# Altium project FlyCtrlV5.1.PrjPcb
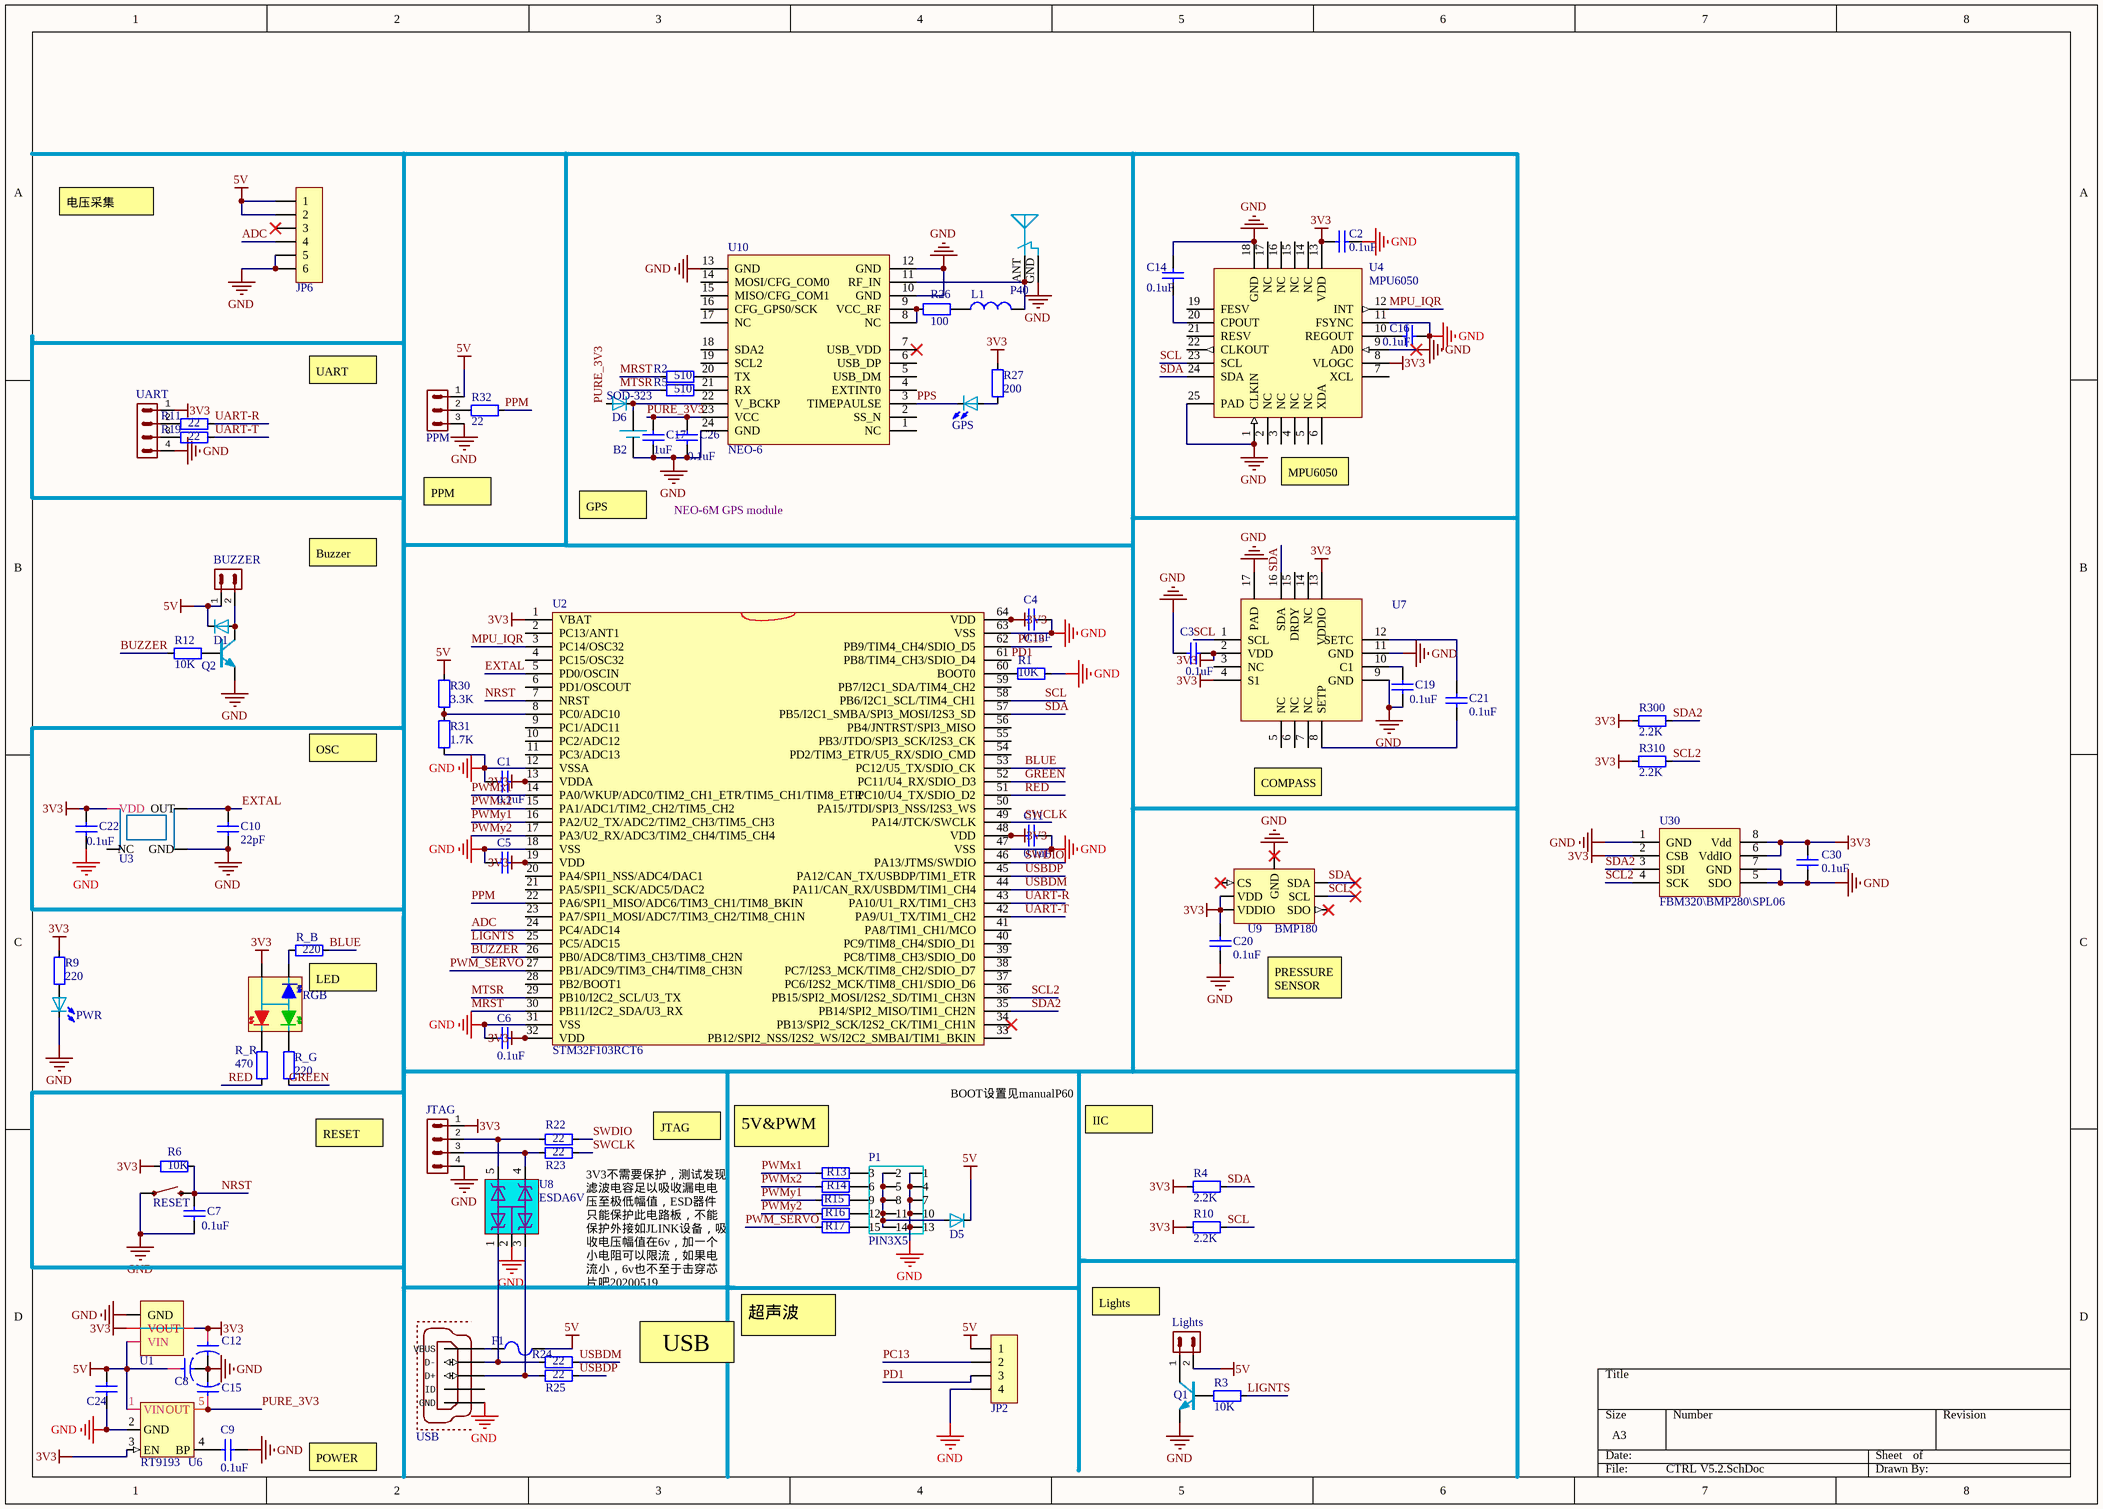
[diagram p0: CTRL V5.2.SchDoc]
2 sheets, 193 parts. Net scope: global (net labels, ports and power ports of the same name join across sheets).
Board files: CTRL V5.PcbDoc, CTRL V5.2.PcbDoc
Sheets:
  CTRL V5.2.SchDoc
  CTRL V5.SchDoc

## Sheet CTRL V5.2.SchDoc
size A3

### Parts
(Parts that share a designator on the sheet are numbered #1, #2 ... from top to bottom, then left to right.)
B2#1  XH414  [XH414]  (value not drawn)
BUZZER#1  DF13C-2P  [DF13C-2P-1.25V]  (value not drawn)
C1#1  0.1uF  [0603-CAP]
C2#1  0.1uF  [0603-CAP]
C3#1  0.1uF  [0603-CAP]
C4#1  0.1uF  [0603-CAP]
C5#1  0.1uF  [0603-CAP]  (value not drawn)
C6#1  0.1uF  [0603-CAP]
C7  0.1uF  [0603-CAP]
C8#1  10uF  [TAJ-A(1206)[3216]]  (value not drawn)
C9#1  0.1uF  [0603-CAP]
C10  22pF  [0603-CAP]
C11#1  0.1uF  [0603-CAP]
C12#1  10uF  [TAJ-A(1206)[3216]]  (value not drawn)
C14#1  0.1uF  [0603-CAP]
C15#1  10uF  [TAJ-A(1206)[3216]]  (value not drawn)
C16#1  0.1uF  [0603-CAP]
C17#1  1uF  [0805-CAP]
C19#1  0.1uF  [0603-CAP]
C20#1  0.1uF  [0603-CAP]
C21#1  0.1uF  [0603-CAP]
C22  0.1uF  [0603-CAP]
C24#1  0.1uF  [0805-CAP]  (value not drawn)
C26#1  0.1uF  [0603-CAP]
C30#1  value 0.1uF  [C_0603]  (hidden comment: C_0603)
D1#1  IN5819  [SOD-323]  (value not drawn)
D5#1  1N4148  [SOD-523]  (value not drawn)
D6#1  SOD-323  [SOD-323]
F1#1  FUSE  [0805-FUS]  (value not drawn)
GPS#1  LED  [0805-LED]  (value not drawn)
JP2  HDR-1X4  [HDR-1X4]  (value not drawn)
JP6  HDR-1X6  [TX1.25 SMD-4P]  (value not drawn)
JTAG#1  PIN HDR 1x4  [PIN4*1]  (value not drawn)
L1#1  value  [0805-IND]  (value not drawn)
Lights#1  DF13C-2P  [DF13C-2P-1.25V]  (value not drawn)
P1#1  PIN3X5  [PIN HDR3X5]
P40#1  IPEX  [IPEX]  (value not drawn)
PPM#1  PIN HDR 1X3  [PIN3*1]  (value not drawn)
PWR#1  LED  [0805-LED]  (value not drawn)
Q1#1  2N3904  [SOT-23]  (value not drawn)
Q2#1  2N3904  [SOT-23]  (value not drawn)
R1#1  10K  [0603-Res]
R2#1  510  [0603-Res]
R3#1  10K  [0603-Res]
R4#1  2.2K  [0603-Res]
R5#1  510  [0603-Res]
R6  10K  [0603-Res]
R9#1  220  [0603-Res]
R10#1  2.2K  [0603-Res]
R11#1  22  [0603-Res]
R12#1  10K  [0603-Res]
R13#1  220  [0603-Res]  (value not drawn)
R14#1  220  [0603-Res]  (value not drawn)
R15#1  220  [0603-Res]  (value not drawn)
R16#1  220  [0603-Res]  (value not drawn)
R17#1  220  [0603-Res]  (value not drawn)
R19#1  22  [0603-Res]
R22#1  22  [0603-Res]
R23#1  22  [0603-Res]
R24#1  22  [0603-Res]
R25#1  22  [0603-Res]
R26#1  100  [0603-Res]
R27#1  200  [0603-Res]
R30  3.3K  [0603-Res]
R31  1.7K  [0603-Res]
R32#1  22  [0603-Res]
R300  2.2K  [0603-Res]
R310  2.2K  [0603-Res]
R_B#1  220  [0603-Res]
R_G#1  220  [0603-Res]
R_R#1  470  [0603-Res]
RESET  KEY_2PIN  [KEY-SMD-2P-1]  (value not drawn)
RGB#1  3528LED  [1210-RGBLED]  (value not drawn)
U1#1  AMS1117-3.3  [SOT-223]  (value not drawn)
U2#1  STM32F103RCT6  [LQFP-64-S]
U3  5032-8M  [XTAL-5032-4P]  (value not drawn)
U4#1  MPU6050  [QFN-24]
U6#1  RT9193  [SOT23-5]
U7#1  HMC5883  [QFN-16-L]  (value not drawn)
U8#1  ESDA6V1W5(Eb1)  [SOT323-5L]
U9#1  BMP180  [BMP180-WITHSHELL]
U10#1  NEO-6  [NEO-6]
U30  FBM320\BMP280\SPL06  [LGA-2_5X2MM]
UART#1  SH1.0-4P  [SH1.0 S-W-4P]  (value not drawn)
USB#1  USB-MICRO  [USB_MICRO]  (value not drawn)

### Nets
3V3: C1#1.1 C2#1.1 C3#1.2 C4#1.2 C5#1.2 C6#1.1 C11#1.2 C12#1.A C20#1.2 C22.2 C30#1.1 JTAG#1.1 R4#1.2 R6.1 R9#1.1 R10#1.2 R27#1.2 R300.2 R310.2 RGB#1.VCC U1#1.2(VOUT) U1#1.4(VOUT) U2#1.1(VBAT) U2#1.13(VDDA) U2#1.19(VDD) U2#1.32(VDD) U2#1.48(VDD) U2#1.64(VDD) U3.4(VDD) U4#1.8(VLOGC) U4#1.13(VDD) U6#1.3(EN) U7#1.2(VDD) U7#1.4(S1) U7#1.13(VDDIO) U9#1.2(VDD) U9#1.3(VDDIO) U30.2(CSB) U30.6(VddIO) U30.8(Vdd) UART#1.1
5V: BUZZER#1.1 C8#1.A C24#1.2 D1#1.C D5#1.C F1#1.1 JP2.1 JP6.1 JP6.2 Lights#1.2 PPM#1.1 R30.1 U1#1.3(VIN) U6#1.1(VIN)
GND: B2#1.GND C1#1.2 C2#1.2 C3#1.1 C4#1.1 C5#1.1 C6#1.2 C7.1 C8#1.C(K) C9#1.2 C10.1 C11#1.1 C12#1.C(K) C14#1.2 C15#1.C(K) C16#1.2 C17#1.1 C19#1.1 C20#1.1 C22.1 C24#1.1 C26#1.1 C30#1.2 JP2.4 JP6.5 JP6.6 JTAG#1.4 P1#1.1 P1#1.4 P1#1.7 P1#1.10 P1#1.13 P40#1.GND PPM#1.3 PWR#1.C Q1#1.1 Q2#1.1 R1#1.1 R31.2 RESET.1 U1#1.1(GND) U2#1.12(VSSA) U2#1.18(VSS) U2#1.31(VSS) U2#1.47(VSS) U2#1.63(VSS) U3.2(GND) U4#1.1(CLKIN) U4#1.9(AD0) U4#1.11(FSYNC) U4#1.18(GND) U4#1.25(PAD) U6#1.2(GND) U7#1.9(GND) U7#1.11(GND) U7#1.17(PAD) U8#1.2(GND) U9#1.7(GND) U10#1.10(GND) U10#1.12(GND) U10#1.13(GND) U10#1.24(GND) U30.1(GND) U30.5(SDO) U30.7(GND) UART#1.4 USB#1.GND
ADC: JP6.4 U2#1.24(PC4/ADC14)
BLUE: R_B#1.2 U2#1.53(PC12/U5_TX/SDIO_CK)
BUZZER: R12#1.2 U2#1.26(PB0/ADC8/TIM3_CH3/TIM8_CH2N)
EXTAL: C10.2 U2#1.5(PD0/OSCIN) U3.3(OUT)
GREEN: R_G#1.2 U2#1.52(PC11/U4_RX/SDIO_D3)
LIGNTS: R3#1.1 U2#1.25(PC5/ADC15)
MPU_IQR: U2#1.3(PC14/OSC32) U4#1.12(INT)
MRST: R2#1.1 U2#1.30(PB11/I2C2_SDA/U3_RX)
MTSR: R5#1.1 U2#1.29(PB10/I2C2_SCL/U3_TX)
NRST: C7.2 R6.2 RESET.2 U2#1.7(NRST)
PC13: JP2.2 U2#1.62(PB9/TIM4_CH4/SDIO_D5)
PD1: JP2.3 U2#1.61(PB8/TIM4_CH3/SDIO_D4)
PPM: R32#1.1 U2#1.22(PA6/SPI1_MISO/ADC6/TIM3_CH1/TIM8_BKIN)
PPS: GPS#1.C U10#1.3(TIMEPAULSE)
PURE_3V3: C15#1.A C17#1.2 C26#1.2 D6#1.A U6#1.5(OUT) U10#1.23(VCC)
PWM_SERVO: R17#1.2 U2#1.27(PB1/ADC9/TIM3_CH4/TIM8_CH3N)
PWMx1: R13#1.2 U2#1.14(PA0/WKUP/ADC0/TIM2_CH1_ETR/TIM5_CH1/TIM8_ETR)
PWMx2: R14#1.2 U2#1.15(PA1/ADC1/TIM2_CH2/TIM5_CH2)
PWMy1: R15#1.2 U2#1.16(PA2/U2_TX/ADC2/TIM2_CH3/TIM5_CH3)
PWMy2: R16#1.2 U2#1.17(PA3/U2_RX/ADC3/TIM2_CH4/TIM5_CH4)
RED: R_R#1.2 U2#1.51(PC10/U4_TX/SDIO_D2)
SCL: R10#1.1 U2#1.58(PB6/I2C1_SCL/TIM4_CH1) U4#1.23(SCL) U7#1.1(SCL) U9#1.5(SCL)
SCL2: R310.1 U2#1.36(PB15/SPI2_MOSI/I2S2_SD/TIM1_CH3N) U30.4(SCK)
SDA: R4#1.1 U2#1.57(PB5/I2C1_SMBA/SPI3_MOSI/I2S3_SD) U4#1.24(SDA) U7#1.16(SDA) U9#1.6(SDA)
SDA2: R300.1 U2#1.35(PB14/SPI2_MISO/TIM1_CH2N) U30.3(SDI)
SWCLK: R23#1.2 U2#1.49(PA14/JTCK/SWCLK)
SWDIO: R22#1.2 U2#1.46(PA13/JTMS/SWDIO)
UART-R: R11#1.2 U2#1.43(PA10/U1_RX/TIM1_CH3)
UART-T: R19#1.2 U2#1.42(PA9/U1_TX/TIM1_CH2)
USBDM: R24#1.2 U2#1.44(PA11/CAN_RX/USBDM/TIM1_CH4)
USBDP: R25#1.2 U2#1.45(PA12/CAN_TX/USBDP/TIM1_ETR)
NetB2#1_VCC: B2#1.VCC D6#1.C U10#1.22(V_BCKP)
NetBUZZER#1_2: BUZZER#1.2 D1#1.A Q2#1.3
NetC9#1_1: C9#1.1 U6#1.4(BP)
NetC14#1_1: C14#1.1 U4#1.20(CPOUT)
NetC16#1_1: C16#1.1 U4#1.10(REGOUT)
NetC19#1_2: C19#1.2 U7#1.10(C1)
NetC21#1_1: C21#1.1 U7#1.8(SETP)
NetC21#1_2: C21#1.2 U7#1.12(SETC)
NetD5#1_A: D5#1.A P1#1.2 P1#1.5 P1#1.8 P1#1.11 P1#1.14
NetF1#1_2: F1#1.2 USB#1.VBUS
NetGPS#1_A: GPS#1.A R27#1.1
NetJTAG#1_2: JTAG#1.2 R22#1.1 U8#1.5(D4)
NetJTAG#1_3: JTAG#1.3 R23#1.1 U8#1.4(D3)
NetL1#1_1: L1#1.1 R26#1.2
NetL1#1_2: L1#1.2 P40#1.ANT U10#1.11(RF_IN)
NetLights#1_1: Lights#1.1 Q1#1.3
NetP1#1_3: P1#1.3 R13#1.1
NetP1#1_6: P1#1.6 R14#1.1
NetP1#1_9: P1#1.9 R15#1.1
NetP1#1_12: P1#1.12 R16#1.1
NetP1#1_15: P1#1.15 R17#1.1
NetPPM#1_2: PPM#1.2 R32#1.2
NetPWR#1_A: PWR#1.A R9#1.2
NetQ1#1_2: Q1#1.2 R3#1.2
NetQ2#1_2: Q2#1.2 R12#1.1
NetR1#1_2: R1#1.2 U2#1.60(BOOT0)
NetR2#1_2: R2#1.2 U10#1.20(TX)
NetR5#1_2: R5#1.2 U10#1.21(RX)
NetR11#1_1: R11#1.1 UART#1.2
NetR19#1_1: R19#1.1 UART#1.3
NetR24#1_1: R24#1.1 U8#1.1(D1) USB#1.D-
NetR25#1_1: R25#1.1 U8#1.3(D2) USB#1.D+
NetR26#1_1: R26#1.1 U10#1.8(NC) U10#1.9(VCC_RF)
NetR30_2: R30.2 R31.1 U2#1.8(PC0/ADC10)
NetR_B#1_1: R_B#1.1 RGB#1.B
NetR_G#1_1: R_G#1.1 RGB#1.G
NetR_R#1_1: R_R#1.1 RGB#1.R

Not connected (* = marked no-connect by the designer): JP6 3*; U2#1 2(PC13/ANT1) 4(PC15/OSC32) 6(PD1/OSCOUT) 9(PC1/ADC11) 10(PC2/ADC12) 11(PC3/ADC13) 20(PA4/SPI1_NSS/ADC4/DAC1) 21(PA5/SPI1_SCK/ADC5/DAC2) 23(PA7/SPI1_MOSI/ADC7/TIM3_CH2/TIM8_CH1N) 28(PB2/BOOT1) 33(PB12/SPI2_NSS/I2S2_WS/I2C2_SMBAI/TIM1_BKIN) 34(PB13/SPI2_SCK/I2S2_CK/TIM1_CH1N)* 37(PC6/I2S2_MCK/TIM8_CH1/SDIO_D6) 38(PC7/I2S3_MCK/TIM8_CH2/SDIO_D7) 39(PC8/TIM8_CH3/SDIO_D0) 40(PC9/TIM8_CH4/SDIO_D1) 41(PA8/TIM1_CH1/MCO) 50(PA15/JTDI/SPI3_NSS/I2S3_WS) 54(PD2/TIM3_ETR/U5_RX/SDIO_CMD) 55(PB3/JTDO/SPI3_SCK/I2S3_CK) 56(PB4/JNTRST/SPI3_MISO) 59(PB7/I2C1_SDA/TIM4_CH2); U3 1(NC); U4#1 2(NC) 3(NC) 4(NC) 5(NC) 6(XDA) 7(XCL) 14(NC) 15(NC) 16(NC) 17(NC) 19(FESV) 21(RESV) 22(CLKOUT); U7#1 3(NC) 5(NC) 6(NC) 7(NC) 14(NC) 15(DRDY); U9#1 1(CS)* 4(SDO)*; U10#1 1(NC) 2(SS_N) 4(EXTINT0) 5(USB_DM) 6(USB_DP) 7(USB_VDD)* 14(MOSI/CFG_COM0) 15(MISO/CFG_COM1) 16(CFG_GPS0/SCK) 17(NC) 18(SDA2) 19(SCL2); USB#1 ID

### Notes on the sheet
- 电压采集
- UART
- PPM
- GPS
- NEO-6M GPS module
- (near U4#1) MPU6050
- Buzzer
- OSC
- COMPASS
- LED
- PRESSURE SENSOR
- BOOT设置见manualP60
- IIC
- RESET
- JTAG
- 5V&PWM
- 3V3不需要保护，测试发现滤波电容足以吸收漏电电压至极低幅值，ESD器件只能保护此电路板，不能保护外接如JLINK设备，吸收电压幅值在6v，加一个小电阻可以限流，如果电流小，6v也不至于击穿芯片吧20200519
- Lights
- USB
- 超声波
- POWER

### Library data of the parts
B2#1 = XH414: XH414贴片法拉电容φ4.7
BUZZER#1 = PIN HDR 1x2: DF13C-2PHeader, 2-Pin; LatestRevisionDate: 17-Jul-2002; LatestRevisionNote: Re-released for DXP Platform.; Publisher: Altium Limited
C1#1 C2#1 C3#1 C4#1 C5#1 C6#1 C7 C9#1 C11#1 C14#1 C16#1 C19#1 C20#1 C21#1 C22 C24#1 C26#1 = Cap: 无极性Cap; Voltage: 50V; Published: 8-Jun-2000; LatestRevisionDate: 17-Jul-2002; LatestRevisionNote: Re-released for DXP Platform.; PackageReference: RAD-0.3; Publisher: Altium Limited; PackageDescription: Radial Cap, Thru-Hole; 2 Leads; 0.3 in Pin Spacing; Footprint: 0603; Value: 0.1uF
C8#1 C12#1 C15#1 = Cap_p: 有极性Cap
C10 C17#1 = Cap: 无极性Cap; Voltage: 50V; Value: 0.1uF; Published: 8-Jun-2000; LatestRevisionDate: 17-Jul-2002; LatestRevisionNote: Re-released for DXP Platform.; PackageReference: RAD-0.3; Publisher: Altium Limited; PackageDescription: Radial Cap, Thru-Hole; 2 Leads; 0.3 in Pin Spacing; Footprint: 0603
D1#1 = DIODE: 续流
D5#1 D6#1 = DIODE
F1#1 = FUSE: 熔断器
JP2 = Header 4: 4P接插件; 版权归属: 源创客; BOM名称: 4P接插件; 学习资源: www.ooocke.com
JP6 = Header 6: 6P接插件; 版权归属: 源创客; BOM名称: 6P接插件; 学习资源: www.ooocke.com
JTAG#1 = PIN HDR 1x4: 1x4-Pin-connector-JTAG; LatestRevisionDate: 17-Jul-2002; LatestRevisionNote: Re-released for DXP Platform.; Publisher: Altium Limited
L1#1 = Inductor: 电感; value: 27nH
Lights#1 = PIN HDR 1x2: Header, 2-Pin; LatestRevisionDate: 17-Jul-2002; LatestRevisionNote: Re-released for DXP Platform.; Publisher: Altium Limited
P1#1 = PIN HDR3x5
P40#1 = IPEX: IPEX天线座
Q1#1 Q2#1 = NPN: NPN三极管
R1#1 R3#1 R4#1 R6 R9#1 R10#1 R11#1 R12#1 R13#1 R14#1 R15#1 R16#1 R17#1 R19#1 R22#1 R23#1 R24#1 R25#1 R26#1 R27#1 R30 R31 R32#1 R300 R310 R_B#1 R_G#1 R_R#1 = Res: Resistor; Value: 1K; Published: 8-Jun-2000; LatestRevisionDate: 17-Jul-2002; LatestRevisionNote: Re-released for DXP Platform.; PackageReference: AXIAL-0.4; Publisher: Altium Limited; Footprint: 0603
R2#1 R5#1 = RES: Resistor; Value: 1K; Published: 8-Jun-2000; LatestRevisionDate: 17-Jul-2002; LatestRevisionNote: Re-released for DXP Platform.; PackageReference: AXIAL-0.4; Publisher: Altium Limited
RGB#1 = LED-RGB-4PIN
U1#1 = AMS1117
U3 = XTAL-5032-4P: 4PIN-5032晶振
U4#1 = MPU6050: dscrps三轴陀螺仪加速度计
U7#1 = HMC5883: 地磁计
U8#1 = ESDA6V1W5(Eb1): ESD protection
U9#1 = BMP180: Special BOSCH pressure sensor
U10#1 = NEO-6: GPS
U30 = FBM320: 气压计; Published: 8-August-2017; Publisher: mazhongwei; PackageReference: LGA-2_5X2MM
UART#1 = PIN HDR 1x4: SH1.0-4P 1x4-Pin-connector; LatestRevisionDate: 17-Jul-2002; LatestRevisionNote: Re-released for DXP Platform.; Publisher: Altium Limited
USB#1 = USB
C30#1 = C_0603: Published: 8-Jun-2000; LatestRevisionDate: 17-Jul-2002; LatestRevisionNote: Re-released for DXP Platform.; PackageReference: RAD-0.3; Publisher: Altium Limited; PackageDescription: Radial Cap, Thru-Hole; 2 Leads; 0.3 in Pin Spacing

## Sheet CTRL V5.SchDoc
size A3
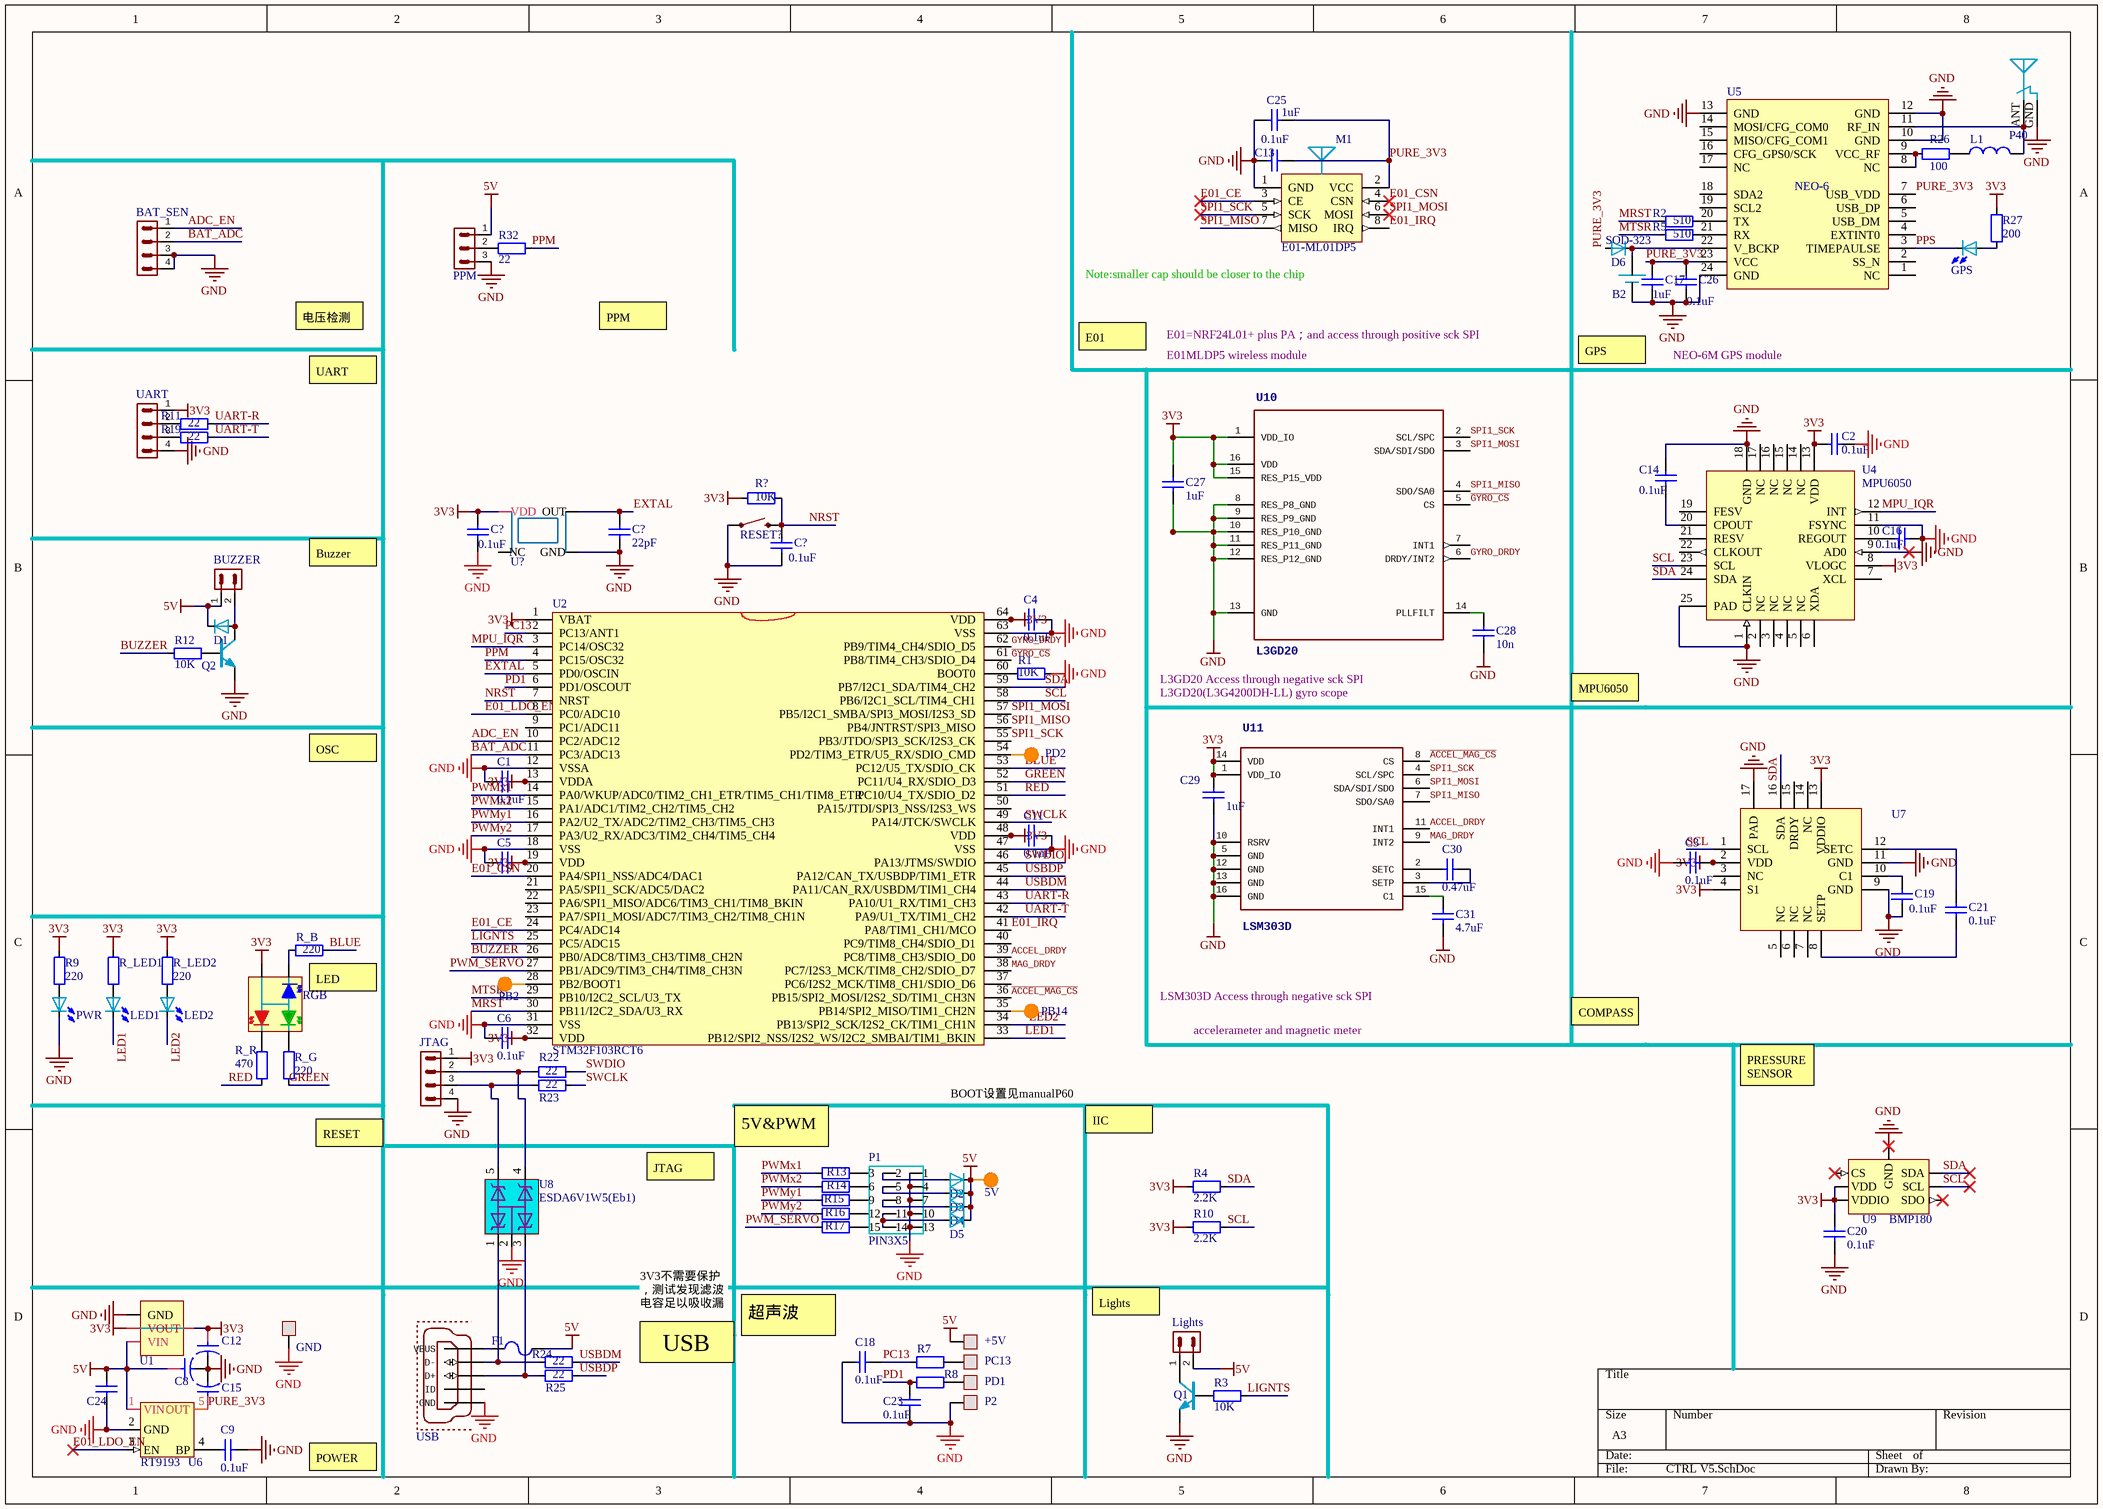
[diagram p1: CTRL V5.SchDoc]

### Parts
(Parts that share a designator on the sheet are numbered #1, #2 ... from top to bottom, then left to right.)
5V  voltage  [TEST_P]  (value not drawn)
+5V  voltage  [PIN1*1]  (value not drawn)
B2#2  XH414  [XH414]  (value not drawn)
BAT_SEN  DF13C-4P  [DF13C-4P-1.25V]  (value not drawn)
BUZZER#2  DF13C-2P  [DF13C-2P-1.25V]  (value not drawn)
C1#2  0.1uF  [0603-CAP]
C2#2  0.1uF  [0603-CAP]
C3#2  0.1uF  [0603-CAP]
C4#2  0.1uF  [0603-CAP]
C5#2  0.1uF  [0603-CAP]  (value not drawn)
C6#2  0.1uF  [0603-CAP]
C8#2  10uF  [TAJ-A(1206)[3216]]  (value not drawn)
C9#2  0.1uF  [0603-CAP]
C11#2  0.1uF  [0603-CAP]
C12#2  10uF  [TAJ-A(1206)[3216]]  (value not drawn)
C13  0.1uF  [0603-CAP]
C14#2  0.1uF  [0603-CAP]
C15#2  10uF  [TAJ-A(1206)[3216]]  (value not drawn)
C16#2  0.1uF  [0603-CAP]
C17#2  1uF  [0805-CAP]
C18  0.1uF  [0603-CAP]
C19#2  0.1uF  [0603-CAP]
C20#2  0.1uF  [0603-CAP]
C21#2  0.1uF  [0603-CAP]
C23  0.1uF  [0603-CAP]
C24#2  0.1uF  [0805-CAP]  (value not drawn)
C25  1uF  [0805-CAP]
C26#2  0.1uF  [0603-CAP]
C27  1uF  [0805-CAP]
C28  10n  [0603-CAP]
C29  1uF  [0805-CAP]
C30#2  0.47uF  [0603-CAP]
C31  4.7uF  [0805-CAP]
C?#1  0.1uF  [0603-CAP]
C?#2  22pF  [0603-CAP]
C?#3  0.1uF  [0603-CAP]
D1#2  shotechy  [SOD-323]  (value not drawn)
D2  1N4148  [SOD-523]  (value not drawn)
D3  1N4148  [SOD-523]  (value not drawn)
D4  1N4148  [SOD-523]  (value not drawn)
D5#2  1N4148  [SOD-523]  (value not drawn)
D6#2  SOD-323  [SOD-323]
F1#2  FUSE  [0805-FUS]  (value not drawn)
GND  voltage  [PIN1*1]  (value not drawn)
GPS#2  LED  [0805-LED]  (value not drawn)
JTAG#2  PIN HDR 1x4  [PIN4*1]  (value not drawn)
L1#2  value  [0805-IND]  (value not drawn)
LED1  LED  [0805-LED]  (value not drawn)
LED2  LED  [0805-LED]  (value not drawn)
Lights#2  DF13C-2P  [DF13C-2P-1.25V]  (value not drawn)
M1  E01-ML01DP5  [E01-ML01DP5 - SMD]
P1#2  PIN3X5  [PIN HDR3X5]
P2  voltage  [PIN1*1]  (value not drawn)
P40#2  IPEX  [IPEX]  (value not drawn)
PB2  voltage  [TEST_P]  (value not drawn)
PB14  voltage  [TEST_P]  (value not drawn)
PC13  voltage  [PIN1*1]  (value not drawn)
PD1  voltage  [PIN1*1]  (value not drawn)
PD2  voltage  [TEST_P]  (value not drawn)
PPM#2  PIN HDR 1X3  [PIN3*1]  (value not drawn)
PWR#2  LED  [0805-LED]  (value not drawn)
Q1#2  2N3904  [SOT-23]  (value not drawn)
Q2#2  2N3904  [SOT-23]  (value not drawn)
R1#2  10K  [0603-Res]
R2#2  510  [0603-Res]
R3#2  10K  [0603-Res]
R4#2  2.2K  [0603-Res]
R5#2  510  [0603-Res]
R7  220  [0603-Res]  (value not drawn)
R8  220  [0603-Res]  (value not drawn)
R9#2  220  [0603-Res]
R10#2  2.2K  [0603-Res]
R11#2  22  [0603-Res]
R12#2  10K  [0603-Res]
R13#2  220  [0603-Res]  (value not drawn)
R14#2  220  [0603-Res]  (value not drawn)
R15#2  220  [0603-Res]  (value not drawn)
R16#2  220  [0603-Res]  (value not drawn)
R17#2  220  [0603-Res]  (value not drawn)
R19#2  22  [0603-Res]
R22#2  22  [0603-Res]
R23#2  22  [0603-Res]
R24#2  22  [0603-Res]
R25#2  22  [0603-Res]
R26#2  100  [0603-Res]
R27#2  200  [0603-Res]
R32#2  22  [0603-Res]
R?  10K  [0603-Res]
R_B#2  220  [0603-Res]
R_G#2  220  [0603-Res]
R_LED1  220  [0603-Res]  (value not drawn)
R_LED2  220  [0603-Res]
R_R#2  470  [0603-Res]
RESET?  KEY_2PIN  [KEY-SMD-2P-1]  (value not drawn)
RGB#2  3528LED  [1210-RGBLED]  (value not drawn)
U1#2  AMS1117-3.3  [SOT-223]  (value not drawn)
U2#2  STM32F103RCT6  [LQFP-64-S]
U4#2  MPU6050  [QFN-24]
U5  NEO-6  [NEO-6]
U6#2  RT9193  [SOT23-5]
U7#2  HMC5883  [QFN-16-L]  (value not drawn)
U8#2  ESDA6V1W5(Eb1)  [SOT323-5L]
U9#2  BMP180  [BMP180-WITHSHELL]
U10#2  L3GD20  [L3G4200DH-MAN]
U11  LSM303D  [LGA-16L]
U?  5032-8M  [XTAL-5032-4P]  (value not drawn)
UART#2  SH1.0-4P  [SH1.0 S-W-4P]  (value not drawn)
USB#2  USB-MICRO  [USB_MICRO]  (value not drawn)

### Nets
3V3: C1#2.1 C2#2.1 C3#2.2 C4#2.2 C5#2.2 C6#2.1 C11#2.2 C12#2.A C20#2.2 C27.2 C29.2 C?#1.2 JTAG#2.1 R4#2.2 R9#2.1 R10#2.2 R27#2.2 R?.1 R_LED1.1 R_LED2.1 RGB#2.VCC U1#2.2(VOUT) U1#2.4(VOUT) U2#2.1(VBAT) U2#2.13(VDDA) U2#2.19(VDD) U2#2.32(VDD) U2#2.48(VDD) U2#2.64(VDD) U4#2.8(VLOGC) U4#2.13(VDD) U7#2.2(VDD) U7#2.4(S1) U7#2.13(VDDIO) U9#2.2(VDD) U9#2.3(VDDIO) U10#2.1(VDD_IO) U10#2.15(RES_P15_VDD) U10#2.16(VDD) U11.1(VDD_IO) U11.14(VDD) U?.4(VDD) UART#2.1
5V: 5V.1 +5V.1 BUZZER#2.1 C8#2.A C24#2.2 D1#2.C D2.C D3.C D4.C D5#2.C F1#2.1 Lights#2.2 PPM#2.1 U1#2.3(VIN) U6#2.1(VIN)
GND: B2#2.GND BAT_SEN.3 BAT_SEN.4 C1#2.2 C2#2.2 C3#2.1 C4#2.1 C5#2.1 C6#2.2 C8#2.C(K) C9#2.2 C11#2.1 C12#2.C(K) C13.1 C14#2.2 C15#2.C(K) C16#2.2 C17#2.1 C18.1 C19#2.1 C20#2.1 C23.1 C24#2.1 C25.2 C26#2.1 C27.1 C28.1 C29.1 C31.1 C?#1.1 C?#2.1 C?#3.1 GND.1 JTAG#2.4 M1.1(GND) P1#2.1 P1#2.4 P1#2.7 P1#2.10 P1#2.13 P2.1 P40#2.GND PPM#2.3 PWR#2.C Q1#2.1 Q2#2.1 R1#2.1 RESET?.1 U1#2.1(GND) U2#2.12(VSSA) U2#2.18(VSS) U2#2.31(VSS) U2#2.47(VSS) U2#2.63(VSS) U4#2.1(CLKIN) U4#2.9(AD0) U4#2.11(FSYNC) U4#2.18(GND) U4#2.25(PAD) U5.10(GND) U5.12(GND) U5.13(GND) U5.24(GND) U6#2.2(GND) U7#2.9(GND) U7#2.11(GND) U7#2.17(PAD) U8#2.2(GND) U9#2.7(GND) U10#2.8(RES_P8_GND) U10#2.9(RES_P9_GND) U10#2.10(RES_P10_GND) U10#2.11(RES_P11_GND) U10#2.12(RES_P12_GND) U10#2.13(GND) U11.5(GND) U11.10(RSRV) U11.12(GND) U11.13(GND) U11.16(GND) U?.2(GND) UART#2.4 USB#2.GND
~{ACCEL_MAG_CS}: U2#2.36(PB15/SPI2_MOSI/I2S2_SD/TIM1_CH3N) U11.8(CS)
ACCEL_DRDY: U2#2.39(PC8/TIM8_CH3/SDIO_D0) U11.11(INT1)
ADC_EN: BAT_SEN.1 U2#2.10(PC2/ADC12)
BAT_ADC: BAT_SEN.2 U2#2.11(PC3/ADC13)
BLUE: R_B#2.2 U2#2.53(PC12/U5_TX/SDIO_CK)
BUZZER: R12#2.2 U2#2.26(PB0/ADC8/TIM3_CH3/TIM8_CH2N)
E01_CE: M1.3(CE) U2#2.24(PC4/ADC14)
E01_CSN: M1.4(CSN) U2#2.20(PA4/SPI1_NSS/ADC4/DAC1)
E01_IRQ: M1.8(IRQ) U2#2.41(PA8/TIM1_CH1/MCO)
E01_LDO_EN: U2#2.8(PC0/ADC10) U6#2.3(EN)
EXTAL: C?#2.2 U2#2.5(PD0/OSCIN) U?.3(OUT)
~{GYRO_CS}: U2#2.61(PB8/TIM4_CH3/SDIO_D4) U10#2.5(CS)
GREEN: R_G#2.2 U2#2.52(PC11/U4_RX/SDIO_D3)
GYRO_DRDY: U2#2.62(PB9/TIM4_CH4/SDIO_D5) U10#2.6(DRDY/INT2)
LED1: LED1.C U2#2.33(PB12/SPI2_NSS/I2S2_WS/I2C2_SMBAI/TIM1_BKIN)
LED2: LED2.C U2#2.34(PB13/SPI2_SCK/I2S2_CK/TIM1_CH1N)
LIGNTS: R3#2.1 U2#2.25(PC5/ADC15)
MAG_DRDY: U2#2.38(PC7/I2S3_MCK/TIM8_CH2/SDIO_D7) U11.9(INT2)
MPU_IQR: U2#2.3(PC14/OSC32) U4#2.12(INT)
MRST: R2#2.1 U2#2.30(PB11/I2C2_SDA/U3_RX)
MTSR: R5#2.1 U2#2.29(PB10/I2C2_SCL/U3_TX)
NRST: C?#3.2 R?.2 RESET?.2 U2#2.7(NRST)
PC13: C18.2 R7.1 U2#2.2(PC13/ANT1)
PD1: C23.2 R8.1 U2#2.6(PD1/OSCOUT)
PPM: R32#2.1 U2#2.4(PC15/OSC32)
PPS: GPS#2.C U5.3(TIMEPAULSE)
PURE_3V3: C13.2 C15#2.A C17#2.2 C25.1 C26#2.2 D6#2.A M1.2(VCC) U5.7(USB_VDD) U5.23(VCC) U6#2.5(OUT)
PWM_SERVO: R17#2.2 U2#2.27(PB1/ADC9/TIM3_CH4/TIM8_CH3N)
PWMx1: R13#2.2 U2#2.14(PA0/WKUP/ADC0/TIM2_CH1_ETR/TIM5_CH1/TIM8_ETR)
PWMx2: R14#2.2 U2#2.15(PA1/ADC1/TIM2_CH2/TIM5_CH2)
PWMy1: R15#2.2 U2#2.16(PA2/U2_TX/ADC2/TIM2_CH3/TIM5_CH3)
PWMy2: R16#2.2 U2#2.17(PA3/U2_RX/ADC3/TIM2_CH4/TIM5_CH4)
RED: R_R#2.2 U2#2.51(PC10/U4_TX/SDIO_D2)
SCL: R10#2.1 U2#2.58(PB6/I2C1_SCL/TIM4_CH1) U4#2.23(SCL) U7#2.1(SCL) U9#2.5(SCL)
SDA: R4#2.1 U2#2.59(PB7/I2C1_SDA/TIM4_CH2) U4#2.24(SDA) U7#2.16(SDA) U9#2.6(SDA)
SPI1_MISO: M1.7(MISO) U2#2.56(PB4/JNTRST/SPI3_MISO) U10#2.4(SDO/SA0) U11.7(SDO/SA0)
SPI1_MOSI: M1.6(MOSI) U2#2.57(PB5/I2C1_SMBA/SPI3_MOSI/I2S3_SD) U10#2.3(SDA/SDI/SDO) U11.6(SDA/SDI/SDO)
SPI1_SCK: M1.5(SCK) U2#2.55(PB3/JTDO/SPI3_SCK/I2S3_CK) U10#2.2(SCL/SPC) U11.4(SCL/SPC)
SWCLK: R23#2.2 U2#2.49(PA14/JTCK/SWCLK)
SWDIO: R22#2.2 U2#2.46(PA13/JTMS/SWDIO)
UART-R: R11#2.2 U2#2.43(PA10/U1_RX/TIM1_CH3)
UART-T: R19#2.2 U2#2.42(PA9/U1_TX/TIM1_CH2)
USBDM: R24#2.2 U2#2.44(PA11/CAN_RX/USBDM/TIM1_CH4)
USBDP: R25#2.2 U2#2.45(PA12/CAN_TX/USBDP/TIM1_ETR)
NetB2#2_VCC: B2#2.VCC D6#2.C U5.22(V_BCKP)
NetBUZZER#2_2: BUZZER#2.2 D1#2.A Q2#2.3
NetC9#2_1: C9#2.1 U6#2.4(BP)
NetC14#2_1: C14#2.1 U4#2.20(CPOUT)
NetC16#2_1: C16#2.1 U4#2.10(REGOUT)
NetC19#2_2: C19#2.2 U7#2.10(C1)
NetC21#2_1: C21#2.1 U7#2.8(SETP)
NetC21#2_2: C21#2.2 U7#2.12(SETC)
NetC28_2: C28.2 U10#2.14(PLLFILT)
NetC30#2_1: C30#2.1 U11.3(SETP)
NetC30#2_2: C30#2.2 U11.2(SETC)
NetC31_2: C31.2 U11.15(C1)
NetD2_A: D2.A P1#2.2
NetD3_A: D3.A P1#2.5
NetD4_A: D4.A P1#2.8
NetD5#2_A: D5#2.A P1#2.11 P1#2.14
NetF1#2_2: F1#2.2 USB#2.VBUS
NetGPS#2_A: GPS#2.A R27#2.1
NetJTAG#2_2: JTAG#2.2 R22#2.1 U8#2.4(D3)
NetJTAG#2_3: JTAG#2.3 R23#2.1 U8#2.5(D4)
NetL1#2_1: L1#2.1 R26#2.2
NetL1#2_2: L1#2.2 P40#2.ANT U5.11(RF_IN)
NetLED1_A: LED1.A R_LED1.2
NetLED2_A: LED2.A R_LED2.2
NetLights#2_1: Lights#2.1 Q1#2.3
NetP1#2_3: P1#2.3 R13#2.1
NetP1#2_6: P1#2.6 R14#2.1
NetP1#2_9: P1#2.9 R15#2.1
NetP1#2_12: P1#2.12 R16#2.1
NetP1#2_15: P1#2.15 R17#2.1
NetPB2_1: PB2.1 U2#2.28(PB2/BOOT1)
NetPB14_1: PB14.1 U2#2.35(PB14/SPI2_MISO/TIM1_CH2N)
NetPC13_1: PC13.1 R7.2
NetPD1_1: PD1.1 R8.2
NetPD2_1: PD2.1 U2#2.54(PD2/TIM3_ETR/U5_RX/SDIO_CMD)
NetPPM#2_2: PPM#2.2 R32#2.2
NetPWR#2_A: PWR#2.A R9#2.2
NetQ1#2_2: Q1#2.2 R3#2.2
NetQ2#2_2: Q2#2.2 R12#2.1
NetR1#2_2: R1#2.2 U2#2.60(BOOT0)
NetR2#2_2: R2#2.2 U5.20(TX)
NetR5#2_2: R5#2.2 U5.21(RX)
NetR11#2_1: R11#2.1 UART#2.2
NetR19#2_1: R19#2.1 UART#2.3
NetR24#2_1: R24#2.1 U8#2.1(D1) USB#2.D-
NetR25#2_1: R25#2.1 U8#2.3(D2) USB#2.D+
NetR26#2_1: R26#2.1 U5.8(NC) U5.9(VCC_RF)
NetR_B#2_1: R_B#2.1 RGB#2.B
NetR_G#2_1: R_G#2.1 RGB#2.G
NetR_R#2_1: R_R#2.1 RGB#2.R

Not connected (* = marked no-connect by the designer): U2#2 9(PC1/ADC11) 21(PA5/SPI1_SCK/ADC5/DAC2) 22(PA6/SPI1_MISO/ADC6/TIM3_CH1/TIM8_BKIN) 23(PA7/SPI1_MOSI/ADC7/TIM3_CH2/TIM8_CH1N) 37(PC6/I2S2_MCK/TIM8_CH1/SDIO_D6) 40(PC9/TIM8_CH4/SDIO_D1) 50(PA15/JTDI/SPI3_NSS/I2S3_WS); U4#2 2(NC) 3(NC) 4(NC) 5(NC) 6(XDA) 7(XCL) 14(NC) 15(NC) 16(NC) 17(NC) 19(FESV) 21(RESV) 22(CLKOUT); U5 1(NC) 2(SS_N) 4(EXTINT0) 5(USB_DM) 6(USB_DP) 14(MOSI/CFG_COM0) 15(MISO/CFG_COM1) 16(CFG_GPS0/SCK) 17(NC) 18(SDA2) 19(SCL2); U7#2 3(NC) 5(NC) 6(NC) 7(NC) 14(NC) 15(DRDY); U9#2 1(CS)* 4(SDO)*; U10#2 7(INT1); U? 1(NC); USB#2 ID

### Notes on the sheet
- (near M1) Note:smaller cap should be closer to the chip
- 电压检测
- UART
- PPM
- E01
- E01MLDP5 wireless module
- E01=NRF24L01+ plus PA；and access through positive sck SPI
- GPS
- NEO-6M GPS module
- Buzzer
- L3GD20 Access through negative sck SPI
- L3GD20(L3G4200DH-LL) gyro scope
- MPU6050
- OSC
- LED
- LSM303D Access through negative sck SPI
- accelerameter and magnetic meter
- COMPASS
- BOOT设置见manualP60
- IIC
- PRESSURE SENSOR
- RESET
- JTAG
- 5V&PWM
- 3V3不需要保护，测试发现滤波电容足以吸收漏电电压至极低幅值，ESD器件只能保护此电路板，不能保护外接如JLINK设备，吸收电压幅值在6v，加一个小电阻可以限流，如果电流小，6v也不至于击穿芯片吧20200519
- Lights
- USB
- (near C18) 超声波
- POWER

### Library data of the parts
5V PB2 PB14 PD2 = TEST: 信号测试点
+5V GND P2 PC13 PD1 = PIN HDR 1x1
B2#2 = XH414: XH414贴片法拉电容φ4.7
BAT_SEN = PIN HDR 1x4: 1x4-Pin-connector; LatestRevisionDate: 17-Jul-2002; LatestRevisionNote: Re-released for DXP Platform.; Publisher: Altium Limited
BUZZER#2 = PIN HDR 1x2: DF13C-2PHeader, 2-Pin; LatestRevisionDate: 17-Jul-2002; LatestRevisionNote: Re-released for DXP Platform.; Publisher: Altium Limited
C1#2 C2#2 C3#2 C4#2 C5#2 C6#2 C9#2 C11#2 C13 C14#2 C16#2 C18 C19#2 C20#2 C21#2 C23 C24#2 C26#2 C?#1 C?#3 = Cap: 无极性Cap; Voltage: 50V; Published: 8-Jun-2000; LatestRevisionDate: 17-Jul-2002; LatestRevisionNote: Re-released for DXP Platform.; PackageReference: RAD-0.3; Publisher: Altium Limited; PackageDescription: Radial Cap, Thru-Hole; 2 Leads; 0.3 in Pin Spacing; Footprint: 0603; Value: 0.1uF
C8#2 C12#2 C15#2 = Cap_p: 有极性Cap
C17#2 C25 C27-C29 C30#2 C31 C?#2 = Cap: 无极性Cap; Voltage: 50V; Value: 0.1uF; Published: 8-Jun-2000; LatestRevisionDate: 17-Jul-2002; LatestRevisionNote: Re-released for DXP Platform.; PackageReference: RAD-0.3; Publisher: Altium Limited; PackageDescription: Radial Cap, Thru-Hole; 2 Leads; 0.3 in Pin Spacing; Footprint: 0603
D1#2 D2-D4 D5#2 D6#2 = DIODE
F1#2 = FUSE: 熔断器
JTAG#2 = PIN HDR 1x4: 1x4-Pin-connector-JTAG; LatestRevisionDate: 17-Jul-2002; LatestRevisionNote: Re-released for DXP Platform.; Publisher: Altium Limited
L1#2 = Inductor: 电感
Lights#2 = PIN HDR 1x2: Header, 2-Pin; LatestRevisionDate: 17-Jul-2002; LatestRevisionNote: Re-released for DXP Platform.; Publisher: Altium Limited
M1 = E01-ML01DP5: 无线模块E01-ML01DP5
P1#2 = PIN HDR3x5
P40#2 = IPEX: IPEX天线座
Q1#2 Q2#2 = NPN: NPN三极管
R1#2 R3#2 R4#2 R9#2 R10#2 R11#2 R12#2 R13#2 R14#2 R15#2 R16#2 R17#2 R19#2 R22#2 R23#2 R24#2 R25#2 R26#2 R27#2 R32#2 R? R_B#2 R_G#2 R_LED1 R_LED2 R_R#2 = Res: Resistor; Value: 1K; Published: 8-Jun-2000; LatestRevisionDate: 17-Jul-2002; LatestRevisionNote: Re-released for DXP Platform.; PackageReference: AXIAL-0.4; Publisher: Altium Limited; Footprint: 0603
R2#2 R5#2 R7 R8 = RES: Resistor; Value: 1K; Published: 8-Jun-2000; LatestRevisionDate: 17-Jul-2002; LatestRevisionNote: Re-released for DXP Platform.; PackageReference: AXIAL-0.4; Publisher: Altium Limited
RGB#2 = LED-RGB-4PIN
U1#2 = AMS1117
U4#2 = MPU6050: dscrps三轴陀螺仪加速度计
U5 = NEO-6: GPS
U7#2 = HMC5883: 地磁计
U8#2 = ESDA6V1W5(Eb1): ESD protection
U9#2 = BMP180: Special BOSCH pressure sensor
U10#2 = L3G4200DH-LL: <h3>L3G4200DH - Digital 3-axis Gyroscope</h3> / The L3G4200DH is a low-power three-axis / angular rate sensor. The L3G4200DH has a full scale of ±250/±500/ / ±2000 dps and is capable of measuring rates with / a user-selectable bandwidth. It can operate within a / temperature range from -40 °C to +85 °C. Supply voltage: 2.4 V to 3.6 V. Full datasheet:<br /><br /> / <a href="http://www.st.com/stonline/products/literature/ds/17300.pdf">L3G4200DH Datasheet</a>; PARTNO: L3GD20
U11 = LSM303D: <b>LSM303D Ultra compact high performance e-compass: 3D accelerometer and 3D magnetometer module</b>; DATASHEET: http://www.st.com/internet/com/TECHNICAL_RESOURCES/TECHNICAL_LITERATURE/DATASHEET/DM00057547.pdf; LINK: http://www.st.com/internet/analog/product/253884.jsp; MFGPN: LSM303D; PARTNO: LSM303D
U? = XTAL-5032-4P: 4PIN-5032晶振
UART#2 = PIN HDR 1x4: SH1.0-4P 1x4-Pin-connector; LatestRevisionDate: 17-Jul-2002; LatestRevisionNote: Re-released for DXP Platform.; Publisher: Altium Limited
USB#2 = USB

## Nets that join several sheets
3V3: CTRL V5.2 (41 pins), CTRL V5 (43 pins)
5V: CTRL V5.2 (14 pins), CTRL V5 (15 pins)
GND: CTRL V5.2 (67 pins), CTRL V5 (83 pins)
BLUE: CTRL V5.2 (R_B#1.2 U2#1.53), CTRL V5 (R_B#2.2 U2#2.53)
BUZZER: CTRL V5.2 (R12#1.2 U2#1.26), CTRL V5 (R12#2.2 U2#2.26)
EXTAL: CTRL V5.2 (C10.2 U2#1.5 U3.3), CTRL V5 (C?#2.2 U2#2.5 U?.3)
GREEN: CTRL V5.2 (R_G#1.2 U2#1.52), CTRL V5 (R_G#2.2 U2#2.52)
LIGNTS: CTRL V5.2 (R3#1.1 U2#1.25), CTRL V5 (R3#2.1 U2#2.25)
MPU_IQR: CTRL V5.2 (U2#1.3 U4#1.12), CTRL V5 (U2#2.3 U4#2.12)
MRST: CTRL V5.2 (R2#1.1 U2#1.30), CTRL V5 (R2#2.1 U2#2.30)
MTSR: CTRL V5.2 (R5#1.1 U2#1.29), CTRL V5 (R5#2.1 U2#2.29)
NRST: CTRL V5.2 (C7.2 R6.2 RESET.2 U2#1.7), CTRL V5 (C?#3.2 R?.2 RESET?.2 U2#2.7)
PC13: CTRL V5.2 (JP2.2 U2#1.62), CTRL V5 (C18.2 R7.1 U2#2.2)
PD1: CTRL V5.2 (JP2.3 U2#1.61), CTRL V5 (C23.2 R8.1 U2#2.6)
PPM: CTRL V5.2 (R32#1.1 U2#1.22), CTRL V5 (R32#2.1 U2#2.4)
PPS: CTRL V5.2 (GPS#1.C U10#1.3), CTRL V5 (GPS#2.C U5.3)
PURE_3V3: CTRL V5.2 (6 pins), CTRL V5 (10 pins)
PWM_SERVO: CTRL V5.2 (R17#1.2 U2#1.27), CTRL V5 (R17#2.2 U2#2.27)
PWMx1: CTRL V5.2 (R13#1.2 U2#1.14), CTRL V5 (R13#2.2 U2#2.14)
PWMx2: CTRL V5.2 (R14#1.2 U2#1.15), CTRL V5 (R14#2.2 U2#2.15)
PWMy1: CTRL V5.2 (R15#1.2 U2#1.16), CTRL V5 (R15#2.2 U2#2.16)
PWMy2: CTRL V5.2 (R16#1.2 U2#1.17), CTRL V5 (R16#2.2 U2#2.17)
RED: CTRL V5.2 (R_R#1.2 U2#1.51), CTRL V5 (R_R#2.2 U2#2.51)
SCL: CTRL V5.2 (5 pins), CTRL V5 (5 pins)
SDA: CTRL V5.2 (5 pins), CTRL V5 (5 pins)
SWCLK: CTRL V5.2 (R23#1.2 U2#1.49), CTRL V5 (R23#2.2 U2#2.49)
SWDIO: CTRL V5.2 (R22#1.2 U2#1.46), CTRL V5 (R22#2.2 U2#2.46)
UART-R: CTRL V5.2 (R11#1.2 U2#1.43), CTRL V5 (R11#2.2 U2#2.43)
UART-T: CTRL V5.2 (R19#1.2 U2#1.42), CTRL V5 (R19#2.2 U2#2.42)
USBDM: CTRL V5.2 (R24#1.2 U2#1.44), CTRL V5 (R24#2.2 U2#2.44)
USBDP: CTRL V5.2 (R25#1.2 U2#1.45), CTRL V5 (R25#2.2 U2#2.45)